# EAGLE design robot-joystick (EAGLE 7.6.0)
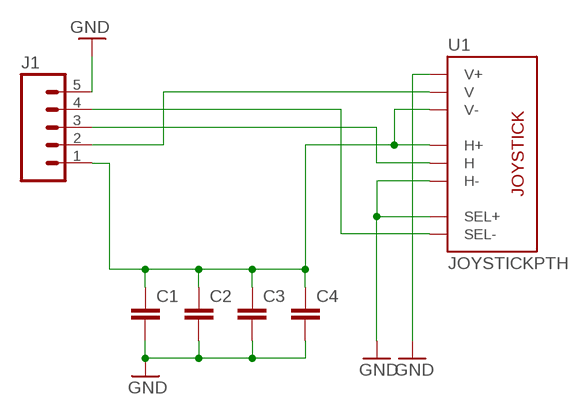
[diagram p0: schematic, sheet 1]

## Parts
C1  C-EUC3216  [C3216]
C2  C-EUC3216  [C3216]
C3  C-EUC3216  [C3216]
C4  C-EUC3216  [C3216]
J1  M05PTH  [1X05]
U1  JOYSTICKPTH  [JOYSTICK]

## Nets
GND: C1.2 C2.2 C3.2 C4.2 J1.5 U1.B1A(SEL+) U1.H3(H-) U1.V1(V+)
N$1: J1.4 U1.B2A(SEL-)
N$2: J1.2 U1.V2(V)
N$4: J1.3 U1.H2(H)
N$6: C1.1 C2.1 C3.1 C4.1 J1.1 U1.H1(H+) U1.V3(V-)

## Library data of the parts
C1-C4 = rcl:C-EU: CAPACITOR, European symbol
J1 = SparkFun-Connectors:M05: Header 5 Standard 5-pin 0.1" header. Use with straight break away headers (SKU : PRT-00116), right angle break away headers (PRT-00553), swiss pins (PRT-00743), machine pins (PRT-00117), and female headers (PRT-00115). Molex polarized connector foot print use with SKU : PRT-08230 with associated crimp pins and housings.
U1 = SparkFun-Electromechanical:JOYSTICK: Thumb Joystick Joystick commonly found in PS2 controllers. Two pots and a select switch. Footprint proven. Spark Fun Electronics SKU : COM-09032

## Board
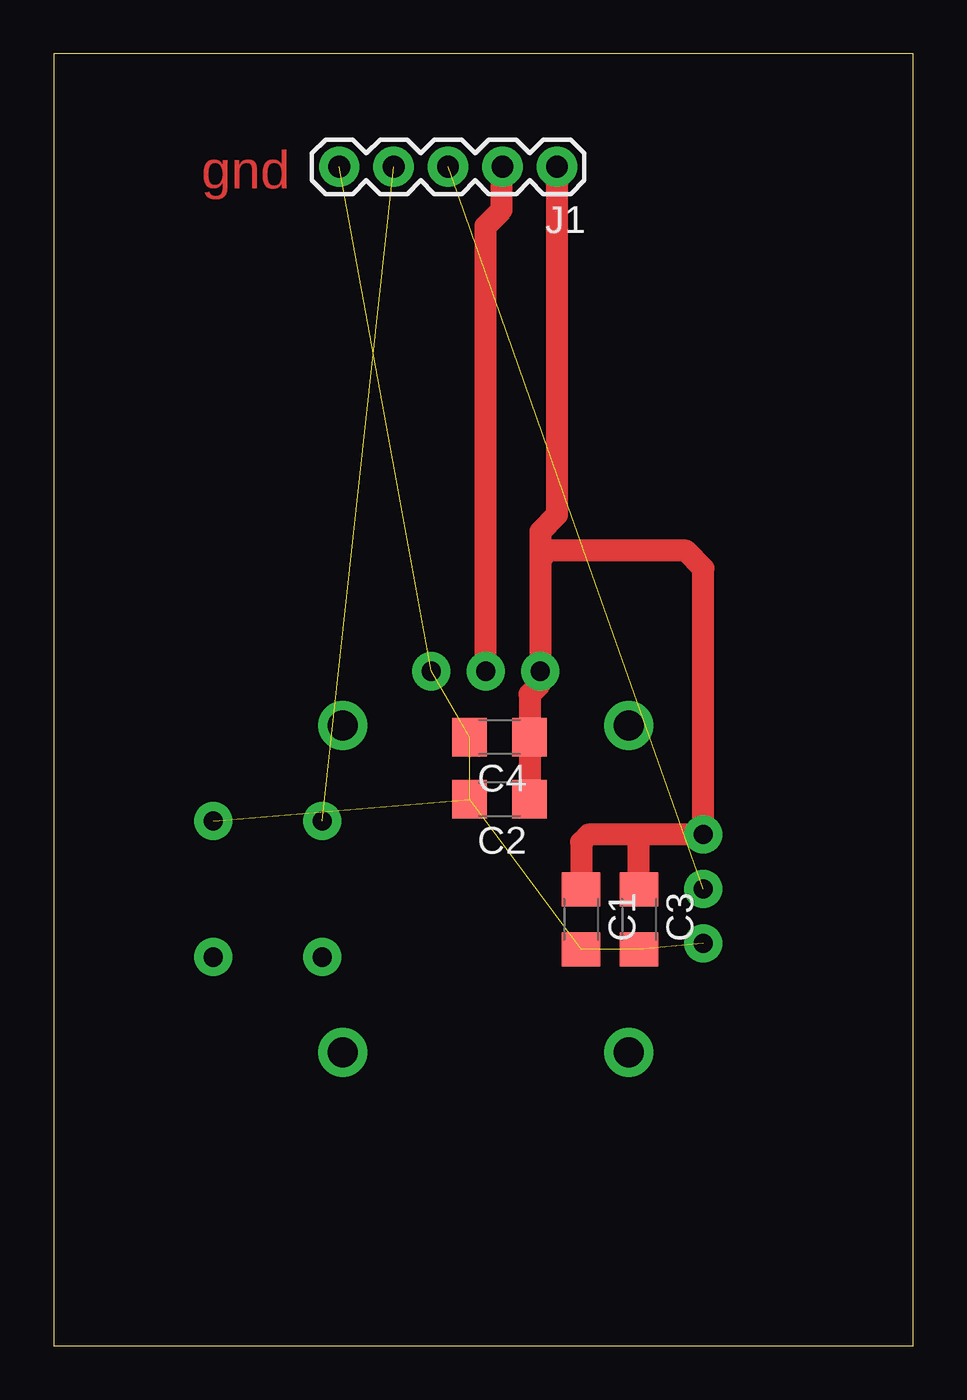
[diagram p1: board, top side]
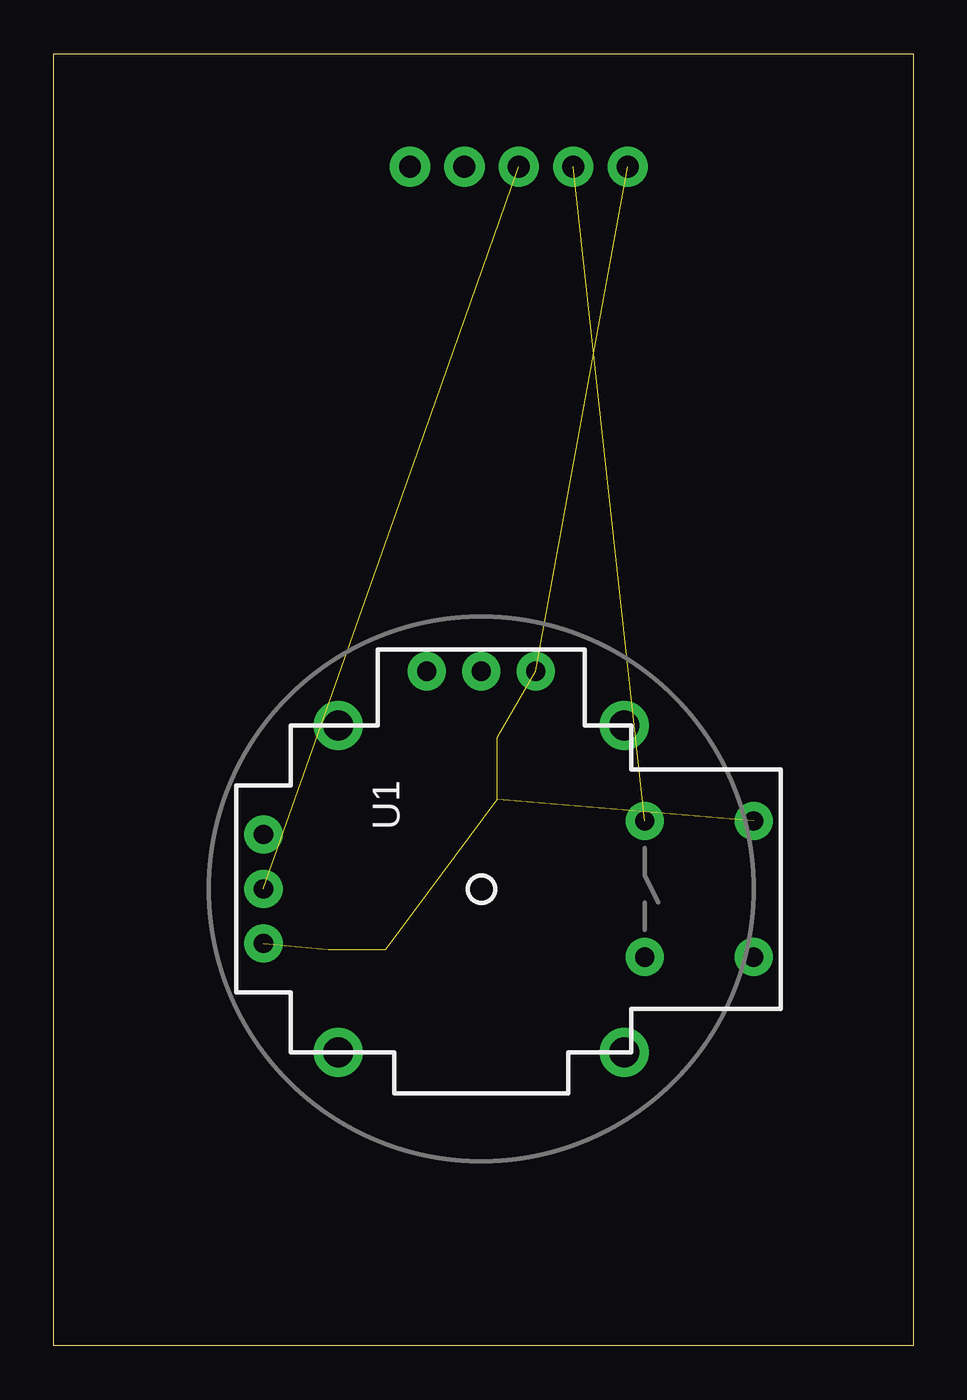
[diagram p2: board, bottom side, seen from below]

Size 40.1 x 60.3 mm. Coordinates in mm from the lower left corner, seen from the top.
Outline: 0,0 40.1,0 40.1,60.3 0,60.3 0,0
Copper layers (1*16): Top 0.035mm / dielectric 1.5mm / Bottom 0.035mm
Design rules "default": minimum track width 10mil, minimum drill 24mil, track to track 8mil, track to pad 8mil, pad to pad 8mil, via to via 8mil, smd to smd 8mil, copper to edge 40mil, drill to drill 8mil, minimum pad ring 10mil, minimum via ring 8mil, stop-mask expansion 4mil, vias tented up to drill 0mil, thermal gap 10mil

### Footprints (pad centres in the part's own frame; a part is rotated, then mirrored left to right if it is on the bottom)
C3216 = smd 1.6 x 1.8: 1 -1.4,0; 2 1.4,0
1X05 = drill 1.016 pad 1.88: 1 0,0; 2 2.54,0; 3 5.08,0; 4 7.62,0; 5 10.16,0
JOYSTICK = drill 0.9 pad 1.778: B1A -3.175,12.7; B1B 3.175,12.7; B2A -3.175,7.62; B2B 3.175,7.62 | drill 0.889 pad 1.778: H1 -2.54,-10.16; H2 0,-10.16; H3 2.54,-10.16; V1 -10.16,2.54; V2 -10.16,0; V3 -10.16,-2.54 | drill 1.397 pad 2.286: MOUNT1 -7.62,6.668; MOUNT2 -7.62,-6.668; MOUNT3 7.62,-6.668; MOUNT4 7.62,6.668

### Placement (x,y rotation side)
C1  24.6,19.9 270 top
C2  20.8,25.5 180 top
C3  27.3,19.9 270 top
C4  20.8,28.4 180 top
J1  23.48,55.02 180 top
U1  20.15,21.32 270 bottom

### Tracks (layer width: path | path; a pad name or v marks a point on that pad's centre or on a via)
GND  (7 unrouted)
N$1  (1 unrouted)
N$2
  Top 1.016: U1.V2 20.15,52.25 20.9,53 20.9,54.98 J1.2
N$4  (1 unrouted)
N$6
  Top 1.016: J1.1 23.48,38.78 22.7,38 22.7,36.7 | 22.7,36.7 U1.V3 22.69,30.89 22.2,30.4 C4.1 C2.1 | 22.7,36.7 23.1,37.1 29.5,37.1 30.31,36.29 U1.H1 27,23.86 | 27,23.86 24.96,23.86 24.6,23.5 C1.1 | C3.1 27.3,23.56 27,23.86

### Text on the board
Top: gnd